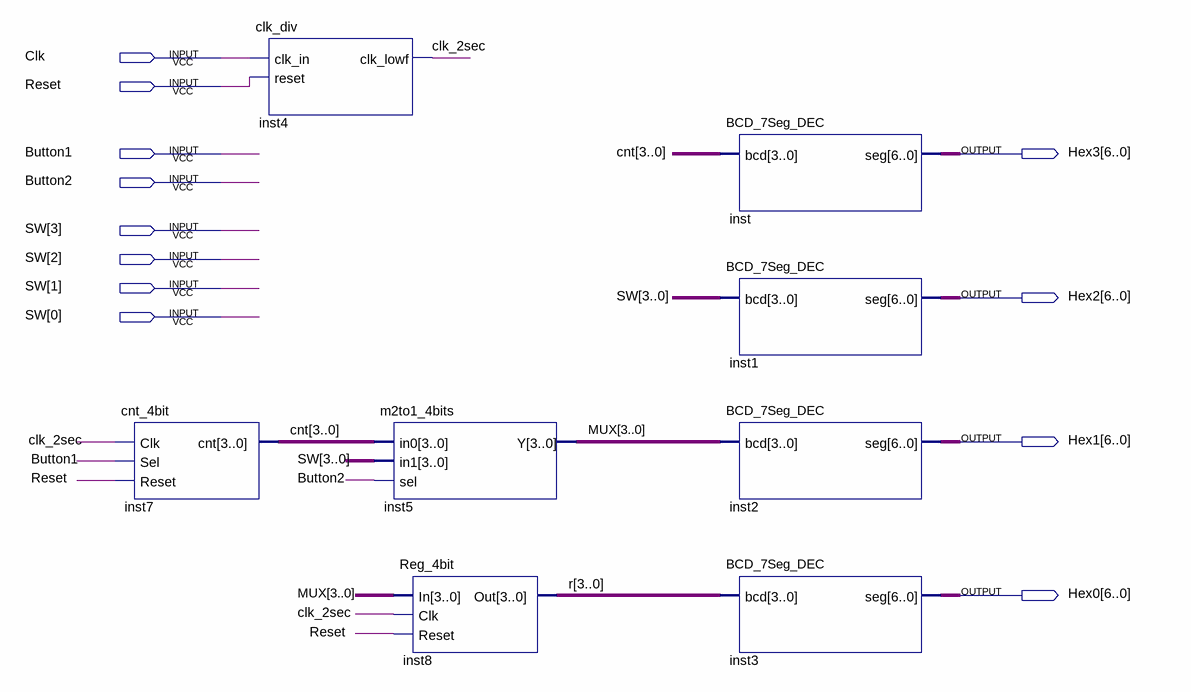
[diagram p0: schematic sheet]
// Quartus schematic FDD_Lab7.bdf as structural Verilog: 8 symbols, 12 pins
module FDD_Lab7 (
  input  Clk,
  input  Reset,
  input  Button1,
  input  Button2,
  input  [3:0] SW,
  output [6:0] Hex3,
  output [6:0] Hex2,
  output [6:0] Hex1,
  output [6:0] Hex0
);

  wire clk_2sec;
  wire [3:0] cnt, MUX, r;

  cnt_4bit inst7 (.Clk(clk_2sec), .Sel(Button1), .Reset(Reset), .cnt(cnt));
  clk_div inst4 (.clk_in(Clk), .reset(Reset), .clk_lowf(clk_2sec));
  m2to1_4bits inst5 (.in0(cnt), .in1(SW), .sel(Button2), .Y(MUX));
  Reg_4bit inst8 (.In(MUX), .Clk(clk_2sec), .Reset(Reset), .Out(r));
  BCD_7Seg_DEC inst (.bcd(cnt), .seg(Hex3));
  BCD_7Seg_DEC inst1 (.bcd(SW), .seg(Hex2));
  BCD_7Seg_DEC inst2 (.bcd(MUX), .seg(Hex1));
  BCD_7Seg_DEC inst3 (.bcd(r), .seg(Hex0));
endmodule
